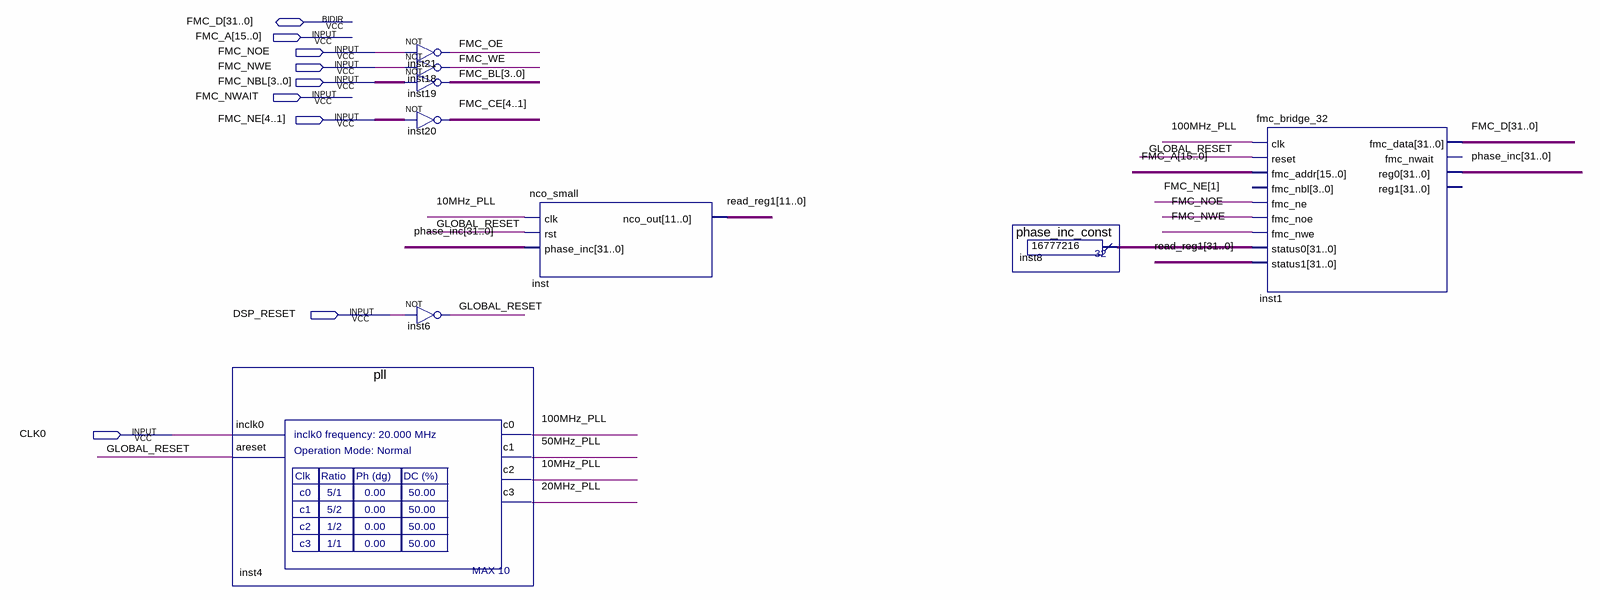
[diagram p0: schematic sheet]
// Quartus schematic max10_fmc_fifo.bdf as structural Verilog: 9 symbols, 9 pins
module max10_fmc_fifo (
  input  [15:0] FMC_A,
  input  FMC_NOE,
  input  FMC_NWE,
  input  [3:0] FMC_NBL,
  input  FMC_NWAIT,
  input  [4:1] FMC_NE,
  input  DSP_RESET,
  input  CLK0,
  inout  [31:0] FMC_D
);

  wire \10MHz_PLL , \20MHz_PLL , \50MHz_PLL , \100MHz_PLL , FMC_OE, FMC_WE, GLOBAL_RESET;
  wire [3:0] FMC_BL;
  wire [4:1] FMC_CE;
  wire [31:0] inst8_result, phase_inc, read_reg1;

  pll inst4 (
    .inclk0(CLK0), .areset(GLOBAL_RESET), .c0(\100MHz_PLL ), .c1(\50MHz_PLL ), .c2(\10MHz_PLL ),
    .c3(\20MHz_PLL ));
  not inst21 (FMC_OE, FMC_NOE);
  not inst18 (FMC_WE, FMC_NWE);
  assign FMC_BL = ~FMC_NBL;  // NOT inst19, 4 bits wide
  assign FMC_CE = ~FMC_NE;  // NOT inst20, 4 bits wide
  not inst6 (GLOBAL_RESET, DSP_RESET);
  nco_small inst (.clk(\10MHz_PLL ), .rst(GLOBAL_RESET), .phase_inc(phase_inc), .nco_out(read_reg1[11:0]));
  phase_inc_const inst8 (.result(inst8_result));
  fmc_bridge_32 inst1 (
    .clk(\100MHz_PLL ), .reset(GLOBAL_RESET), .fmc_addr(FMC_A), .fmc_ne(FMC_NE[1]), .fmc_noe(FMC_NOE),
    .fmc_nwe(FMC_NWE), .status0(inst8_result), .status1(read_reg1), .reg0(phase_inc), .fmc_data(FMC_D));  // open: fmc_nbl, fmc_nwait, reg1
endmodule
